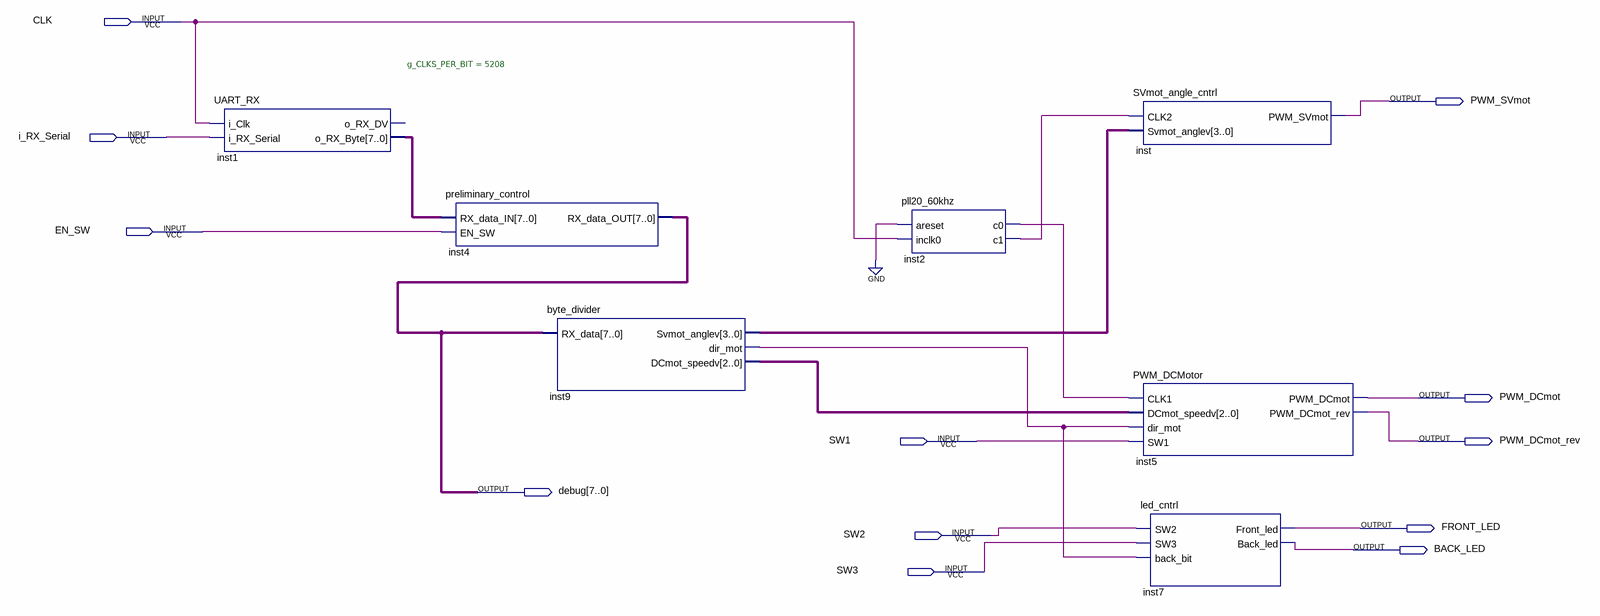
[diagram p0: schematic sheet]
// Quartus schematic Main.bdf as structural Verilog: 7 symbols, 12 pins
module Main (
  input  CLK,
  input  i_RX_Serial,
  input  EN_SW,
  input  SW1,
  input  SW2,
  input  SW3,
  output PWM_SVmot,
  output PWM_DCmot,
  output PWM_DCmot_rev,
  output [7:0] debug,
  output FRONT_LED,
  output BACK_LED
);

  wire inst2_c0, inst2_c1, inst9_dir_mot;
  wire [2:0] inst9_dcmot_speedv;
  wire [3:0] inst9_svmot_anglev;
  wire [7:0] inst1_o_rx_byte;

  UART_RX #(.g_CLKS_PER_BIT(5208)) inst1 (
    .i_Clk(CLK), .i_RX_Serial(i_RX_Serial), .o_RX_Byte(inst1_o_rx_byte));  // open: o_RX_DV
  preliminary_control inst4 (.RX_data_IN(inst1_o_rx_byte), .EN_SW(EN_SW), .RX_data_OUT(debug));
  byte_divider inst9 (
    .RX_data(debug), .Svmot_anglev(inst9_svmot_anglev), .dir_mot(inst9_dir_mot),
    .DCmot_speedv(inst9_dcmot_speedv));
  pll20_60khz inst2 (.areset(1'b0), .inclk0(CLK), .c0(inst2_c0), .c1(inst2_c1));
  SVmot_angle_cntrl inst (.CLK2(inst2_c1), .Svmot_anglev(inst9_svmot_anglev), .PWM_SVmot(PWM_SVmot));
  PWM_DCMotor inst5 (
    .CLK1(inst2_c0), .DCmot_speedv(inst9_dcmot_speedv), .dir_mot(inst9_dir_mot), .SW1(SW1),
    .PWM_DCmot(PWM_DCmot), .PWM_DCmot_rev(PWM_DCmot_rev));
  led_cntrl inst7 (.SW2(SW2), .SW3(SW3), .back_bit(inst9_dir_mot), .Front_led(FRONT_LED), .Back_led(BACK_LED));
endmodule
